# Altium project UWB_Project.PrjPcb
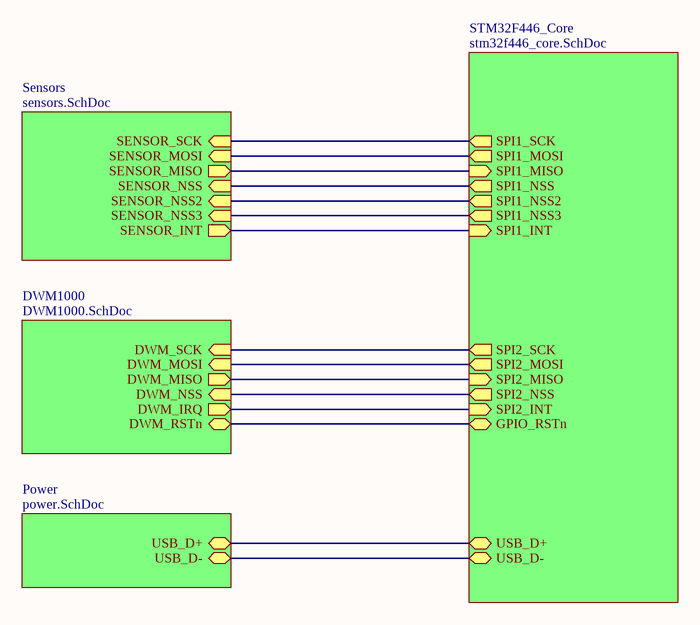
[diagram p0: Top_layer.SchDoc]
5 sheets, 79 parts. Net scope: hierarchical (ports join the sheet entries above them; power ports are global).
Board file: UWB_PCB.PcbDoc
Sheets:
  Top_layer.SchDoc
    STM32F446_Core = stm32f446_core.SchDoc
    Sensors = sensors.SchDoc
    DWM1000 = DWM1000.SchDoc
    Power = power.SchDoc

## Sheet Top_layer.SchDoc
size A

### Sub-sheets
DWM1000 = DWM1000.SchDoc: DWM_NSS (in), DWM_IRQ (out), DWM_MISO (out), DWM_SCK (in), DWM_MOSI (in), DWM_RSTn (bidir)
Power = power.SchDoc: USB_D+ (bidir), USB_D- (bidir)
Sensors = sensors.SchDoc: SENSOR_SCK (in), SENSOR_MOSI (in), SENSOR_MISO (out), SENSOR_NSS (in), SENSOR_NSS2 (in), SENSOR_NSS3 (in), SENSOR_INT (out)
STM32F446_Core = stm32f446_core.SchDoc: USB_D+ (bidir), USB_D- (bidir), SPI1_SCK (out), SPI1_MOSI (out), SPI1_MISO (in), SPI1_NSS (out), SPI1_NSS2 (out), SPI1_NSS3 (out), SPI1_INT (in), SPI2_SCK (out), SPI2_MOSI (out), SPI2_MISO (in), SPI2_NSS (out), SPI2_INT (in), GPIO_RSTn (bidir)

### Nets
AK8975_INT: sheet STM32F446_Core/SPI1_INT, sheet Sensors/SENSOR_INT
AK8975_MISO: sheet STM32F446_Core/SPI1_MISO, sheet Sensors/SENSOR_MISO
AK8975_MOSI: sheet STM32F446_Core/SPI1_MOSI, sheet Sensors/SENSOR_MOSI
AK8975_NSS: sheet STM32F446_Core/SPI1_NSS2, sheet Sensors/SENSOR_NSS2
AK8975_SCK: sheet STM32F446_Core/SPI1_SCK, sheet Sensors/SENSOR_SCK
DWM1000_IRQ: sheet STM32F446_Core/SPI2_INT, sheet DWM1000/DWM_IRQ
DWM1000_MISO: sheet STM32F446_Core/SPI2_MISO, sheet DWM1000/DWM_MISO
DWM1000_MOSI: sheet STM32F446_Core/SPI2_MOSI, sheet DWM1000/DWM_MOSI
DWM1000_NSS: sheet STM32F446_Core/SPI2_NSS, sheet DWM1000/DWM_NSS
DWM1000_RSTn: sheet STM32F446_Core/GPIO_RSTn, sheet DWM1000/DWM_RSTn
DWM1000_SCK: sheet STM32F446_Core/SPI2_SCK, sheet DWM1000/DWM_SCK
ICM20602_NSS: sheet STM32F446_Core/SPI1_NSS, sheet Sensors/SENSOR_NSS
PA11_USB_OTG_FS_DM: sheet STM32F446_Core/USB_D-, sheet Power/USB_D-
PA12_USB_OTG_FS_DP: sheet STM32F446_Core/USB_D+, sheet Power/USB_D+
PB13_SPI1_NSS3: sheet STM32F446_Core/SPI1_NSS3, sheet Sensors/SENSOR_NSS3

## Sheet stm32f446_core.SchDoc
size A3
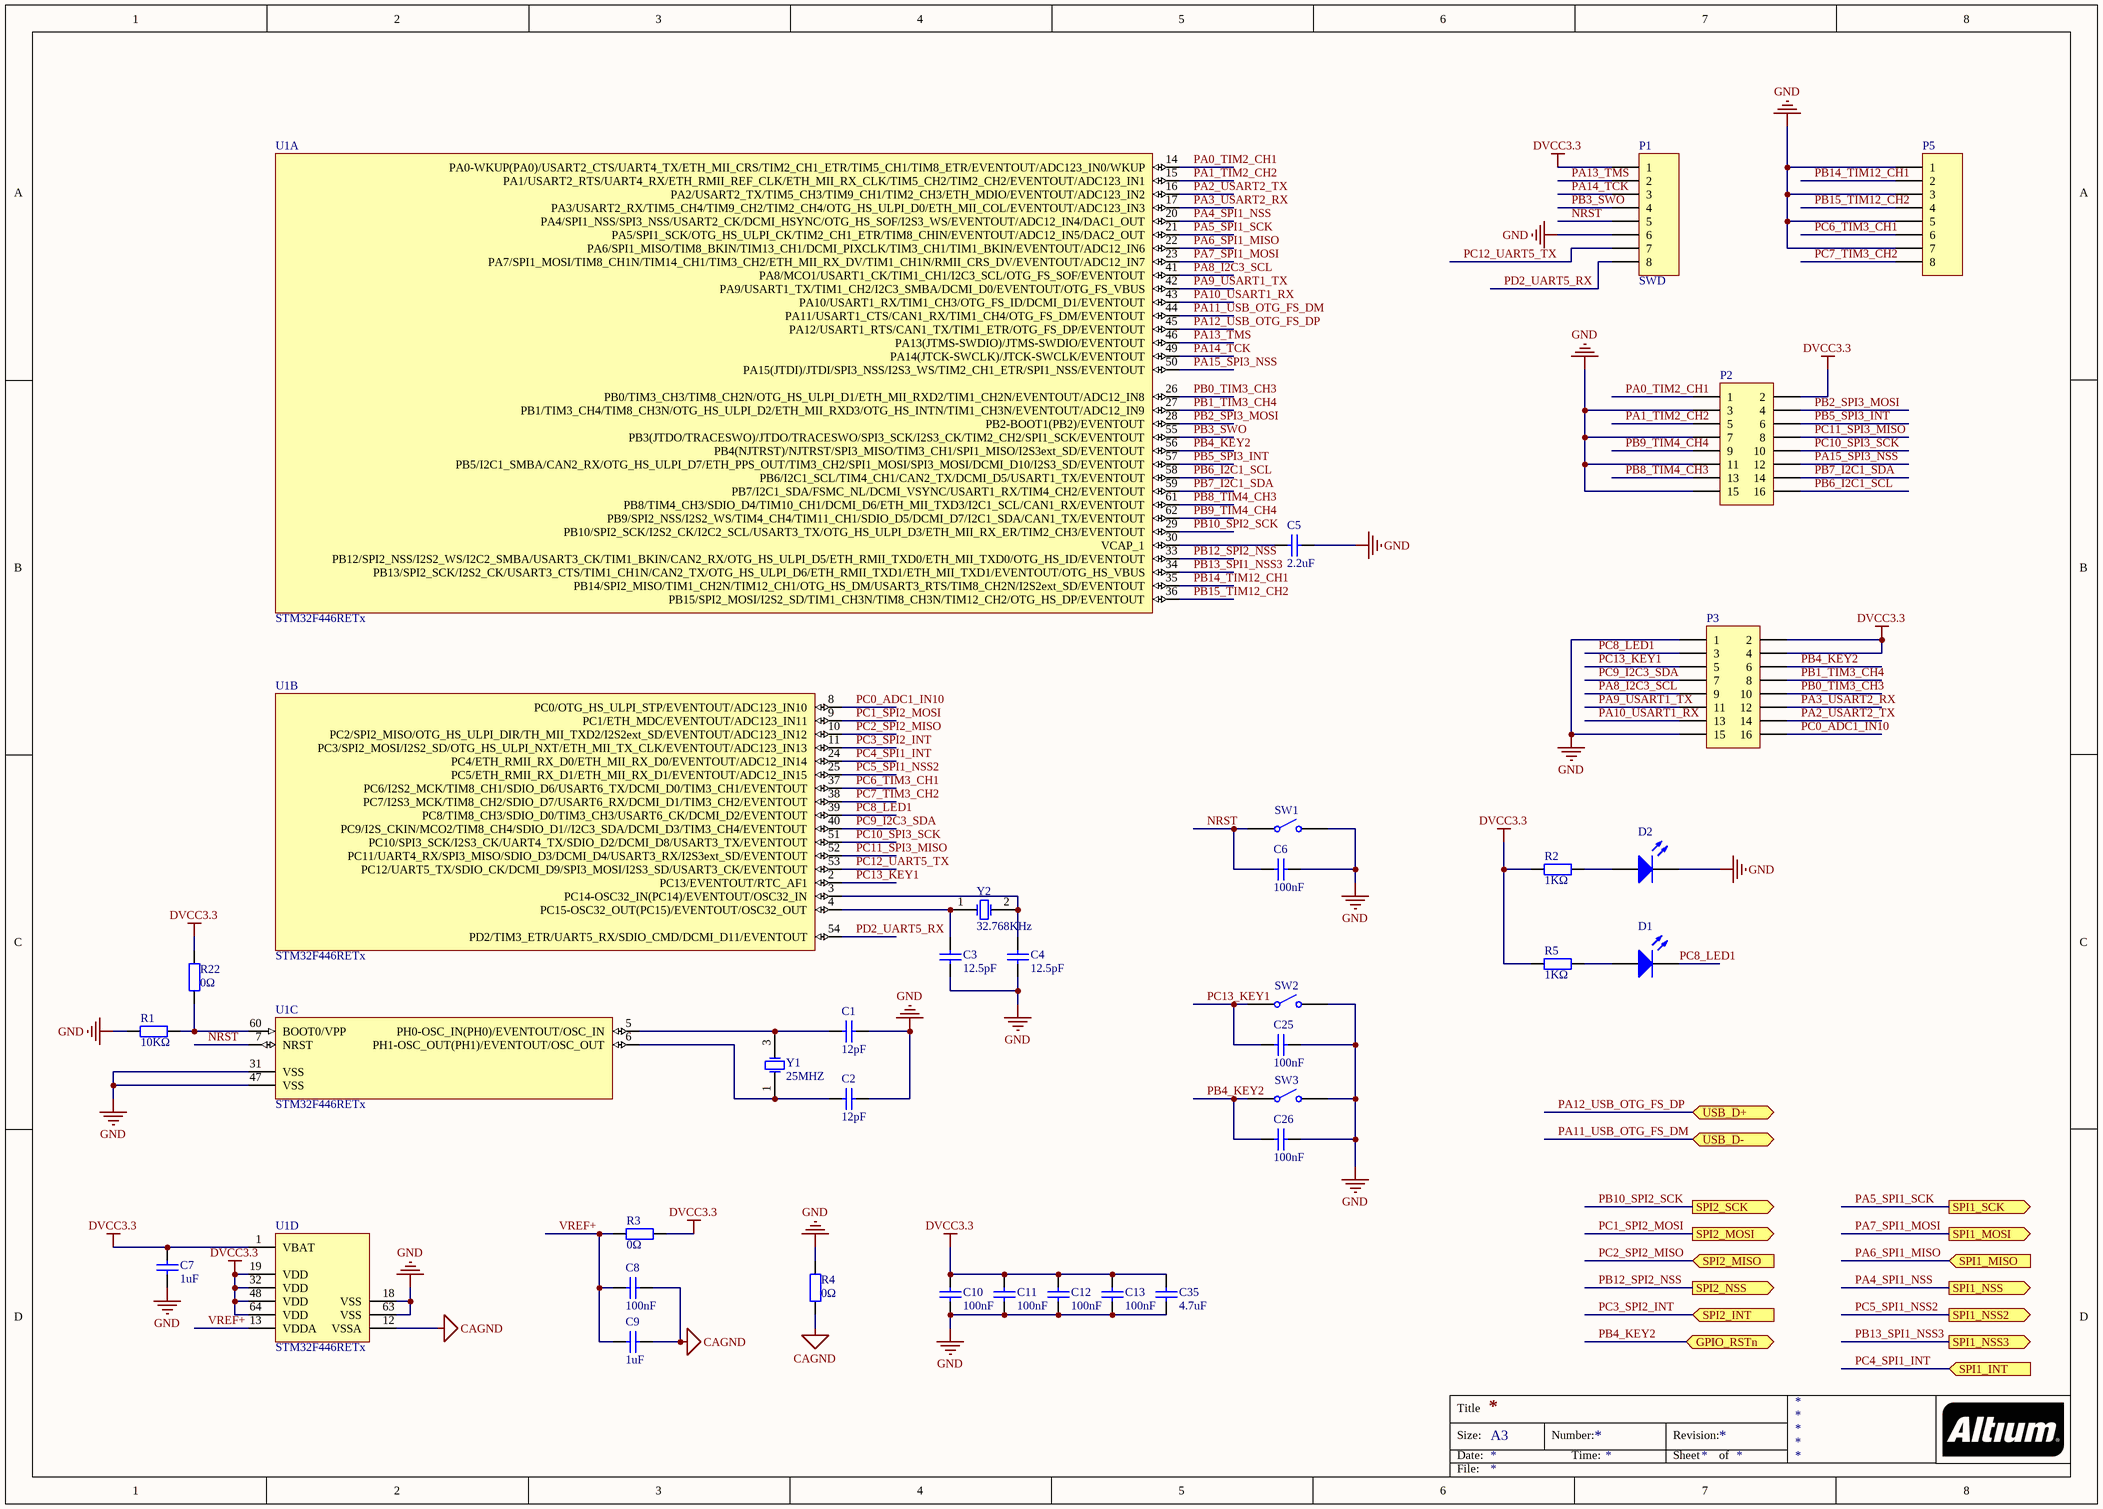
[diagram p1: stm32f446_core.SchDoc]

### Parts
C1  12pF  [0603_C]
C2  12pF  [0603_C]
C3  12.5pF  [0603_C]
C4  12.5pF  [0603_C]
C5  2.2uF  [0603_C]
C6  100nF  [0603_C]
C7  1uF  [0603_C]
C8  100nF  [0603_C]
C9  1uF  [0603_C]
C10  100nF  [0603_C]
C11  100nF  [0603_C]
C12  100nF  [0603_C]
C13  100nF  [0603_C]
C25  100nF  [0603_C]
C26  100nF  [0603_C]
C35  4.7uF  [0603_C]
D1  蓝灯 0805  [0805_LED_S1]  (value not drawn)
D2  蓝灯 0805  [0805_LED_S1]  (value not drawn)
P1  SWD  [HDR1X8]
P2  Header 8X2  [HDR2X8]  (value not drawn)
P3  Header 8X2  [HDR2X8]  (value not drawn)
P5  Header 8  [HDR1X8]  (value not drawn)
R1  10KΩ  [0603_R]
R2  1KΩ  [0603_R]
R3  0Ω  [0603_R]
R4  0Ω  [0603_R]
R5  1KΩ  [0603_R]
R22  0Ω  [0603_R]
SW1  434111025826  [434111025826]  (value not drawn)
SW2  434111025826  [434111025826]  (value not drawn)
SW3  434111025826  [434111025826]  (value not drawn)
U1  STM32F446RETx  [LQFP-64_10x10x05P]  (parts A,B,C,D of 4)
Y1  25MHZ  [SMD-3225_4P]
Y2  32.768KHz  [SMD-3215_2P FC - 135]

### Ports
GPIO_RSTn (bidir), SPI1_INT (in), SPI1_MISO (in), SPI1_MOSI (out), SPI1_NSS2 (out), SPI1_NSS3 (out), SPI1_NSS (out), SPI1_SCK (out), SPI2_INT (in), SPI2_MISO (in), SPI2_MOSI (out), SPI2_NSS (out), SPI2_SCK (out), USB_D+ (bidir), USB_D- (bidir)

### Nets
CAGND: C8.2 C9.2 R4.1 U1.12(VSSA)
DVCC3.3: C7.2 C10.2 C11.2 C12.2 C13.1 C35.2 P1.1 P2.2 P3.2 P3.4 R2.1 R3.2 R5.1 R22.2 U1.1(VBAT) U1.19(VDD) U1.32(VDD) U1.48(VDD) U1.64(VDD)
GND: C1.2 C2.2 C3.1 C4.1 C5.1 C6.2 C7.1 C10.1 C11.1 C12.1 C13.2 C25.2 C26.2 C35.1 D2.K P1.6 P2.3 P2.7 P2.11 P2.15 P3.1 P3.15 P5.1 P5.3 P5.5 P5.7 R1.1 R4.2 SW1.2 SW2.2 SW3.2 U1.18(VSS) U1.31(VSS) U1.47(VSS) U1.63(VSS)
NRST: C6.1 P1.5 SW1.1 U1.7(NRST)
PA0_TIM2_CH1: P2.1 U1.14(PA0-WKUP(PA0)/USART2_CTS/UART4_TX/ETH_MII_CRS/TIM2_CH1_ETR/TIM5_CH1/TIM8_ETR/EVENTOUT/ADC123_IN0/WKUP)
PA1_TIM2_CH2: P2.5 U1.15(PA1/USART2_RTS/UART4_RX/ETH_RMII_REF_CLK/ETH_MII_RX_CLK/TIM5_CH2/TIM2_CH2/EVENTOUT/ADC123_IN1)
PA2_USART2_TX: P3.14 U1.16(PA2/USART2_TX/TIM5_CH3/TIM9_CH1/TIM2_CH3/ETH_MDIO/EVENTOUT/ADC123_IN2)
PA3_USART2_RX: P3.12 U1.17(PA3/USART2_RX/TIM5_CH4/TIM9_CH2/TIM2_CH4/OTG_HS_ULPI_D0/ETH_MII_COL/EVENTOUT/ADC123_IN3)
PA4_SPI1_NSS: U1.20(PA4/SPI1_NSS/SPI3_NSS/USART2_CK/DCMI_HSYNC/OTG_HS_SOF/I2S3_WS/EVENTOUT/ADC12_IN4/DAC1_OUT) ; port SPI1_NSS  [project net ICM20602_NSS]
PA5_SPI1_SCK: U1.21(PA5/SPI1_SCK/OTG_HS_ULPI_CK/TIM2_CH1_ETR/TIM8_CHIN/EVENTOUT/ADC12_IN5/DAC2_OUT) ; port SPI1_SCK  [project net AK8975_SCK]
PA6_SPI1_MISO: U1.22(PA6/SPI1_MISO/TIM8_BKIN/TIM13_CH1/DCMI_PIXCLK/TIM3_CH1/TIM1_BKIN/EVENTOUT/ADC12_IN6) ; port SPI1_MISO  [project net AK8975_MISO]
PA7_SPI1_MOSI: U1.23(PA7/SPI1_MOSI/TIM8_CH1N/TIM14_CH1/TIM3_CH2/ETH_MII_RX_DV/TIM1_CH1N/RMII_CRS_DV/EVENTOUT/ADC12_IN7) ; port SPI1_MOSI  [project net AK8975_MOSI]
PA8_I2C3_SCL: P3.9 U1.41(PA8/MCO1/USART1_CK/TIM1_CH1/I2C3_SCL/OTG_FS_SOF/EVENTOUT)
PA9_USART1_TX: P3.11 U1.42(PA9/USART1_TX/TIM1_CH2/I2C3_SMBA/DCMI_D0/EVENTOUT/OTG_FS_VBUS)
PA10_USART1_RX: P3.13 U1.43(PA10/USART1_RX/TIM1_CH3/OTG_FS_ID/DCMI_D1/EVENTOUT)
PA11_USB_OTG_FS_DM: U1.44(PA11/USART1_CTS/CAN1_RX/TIM1_CH4/OTG_FS_DM/EVENTOUT) ; port USB_D-
PA12_USB_OTG_FS_DP: U1.45(PA12/USART1_RTS/CAN1_TX/TIM1_ETR/OTG_FS_DP/EVENTOUT) ; port USB_D+
PA13_TMS: P1.2 U1.46(PA13(JTMS-SWDIO)/JTMS-SWDIO/EVENTOUT)
PA14_TCK: P1.3 U1.49(PA14(JTCK-SWCLK)/JTCK-SWCLK/EVENTOUT)
PA15_SPI3_NSS: P2.12 U1.50(PA15(JTDI)/JTDI/SPI3_NSS/I2S3_WS/TIM2_CH1_ETR/SPI1_NSS/EVENTOUT)
PB0_TIM3_CH3: P3.10 U1.26(PB0/TIM3_CH3/TIM8_CH2N/OTG_HS_ULPI_D1/ETH_MII_RXD2/TIM1_CH2N/EVENTOUT/ADC12_IN8)
PB1_TIM3_CH4: P3.8 U1.27(PB1/TIM3_CH4/TIM8_CH3N/OTG_HS_ULPI_D2/ETH_MII_RXD3/OTG_HS_INTN/TIM1_CH3N/EVENTOUT/ADC12_IN9)
PB2_SPI3_MOSI: P2.4 U1.28(PB2-BOOT1(PB2)/EVENTOUT)
PB3_SWO: P1.4 U1.55(PB3(JTDO/TRACESWO)/JTDO/TRACESWO/SPI3_SCK/I2S3_CK/TIM2_CH2/SPI1_SCK/EVENTOUT)
PB4_KEY2: C26.1 P3.6 SW3.1 U1.56(PB4(NJTRST)/NJTRST/SPI3_MISO/TIM3_CH1/SPI1_MISO/I2S3ext_SD/EVENTOUT) ; port GPIO_RSTn  [project net DWM1000_RSTn]
PB5_SPI3_INT: P2.6 U1.57(PB5/I2C1_SMBA/CAN2_RX/OTG_HS_ULPI_D7/ETH_PPS_OUT/TIM3_CH2/SPI1_MOSI/SPI3_MOSI/DCMI_D10/I2S3_SD/EVENTOUT)
PB6_I2C1_SCL: P2.16 U1.58(PB6/I2C1_SCL/TIM4_CH1/CAN2_TX/DCMI_D5/USART1_TX/EVENTOUT)
PB7_I2C1_SDA: P2.14 U1.59(PB7/I2C1_SDA/FSMC_NL/DCMI_VSYNC/USART1_RX/TIM4_CH2/EVENTOUT)
PB8_TIM4_CH3: P2.13 U1.61(PB8/TIM4_CH3/SDIO_D4/TIM10_CH1/DCMI_D6/ETH_MII_TXD3/I2C1_SCL/CAN1_RX/EVENTOUT)
PB9_TIM4_CH4: P2.9 U1.62(PB9/SPI2_NSS/I2S2_WS/TIM4_CH4/TIM11_CH1/SDIO_D5/DCMI_D7/I2C1_SDA/CAN1_TX/EVENTOUT)
PB10_SPI2_SCK: U1.29(PB10/SPI2_SCK/I2S2_CK/I2C2_SCL/USART3_TX/OTG_HS_ULPI_D3/ETH_MII_RX_ER/TIM2_CH3/EVENTOUT) ; port SPI2_SCK  [project net DWM1000_SCK]
PB12_SPI2_NSS: U1.33(PB12/SPI2_NSS/I2S2_WS/I2C2_SMBA/USART3_CK/TIM1_BKIN/CAN2_RX/OTG_HS_ULPI_D5/ETH_RMII_TXD0/ETH_MII_TXD0/OTG_HS_ID/EVENTOUT) ; port SPI2_NSS  [project net DWM1000_NSS]
PB13_SPI1_NSS3: U1.34(PB13/SPI2_SCK/I2S2_CK/USART3_CTS/TIM1_CH1N/CAN2_TX/OTG_HS_ULPI_D6/ETH_RMII_TXD1/ETH_MII_TXD1/EVENTOUT/OTG_HS_VBUS) ; port SPI1_NSS3
PB14_TIM12_CH1: P5.2 U1.35(PB14/SPI2_MISO/TIM1_CH2N/TIM12_CH1/OTG_HS_DM/USART3_RTS/TIM8_CH2N/I2S2ext_SD/EVENTOUT)
PB15_TIM12_CH2: P5.4 U1.36(PB15/SPI2_MOSI/I2S2_SD/TIM1_CH3N/TIM8_CH3N/TIM12_CH2/OTG_HS_DP/EVENTOUT)
PC0_ADC1_IN10: P3.16 U1.8(PC0/OTG_HS_ULPI_STP/EVENTOUT/ADC123_IN10)
PC1_SPI2_MOSI: U1.9(PC1/ETH_MDC/EVENTOUT/ADC123_IN11) ; port SPI2_MOSI  [project net DWM1000_MOSI]
PC2_SPI2_MISO: U1.10(PC2/SPI2_MISO/OTG_HS_ULPI_DIR/TH_MII_TXD2/I2S2ext_SD/EVENTOUT/ADC123_IN12) ; port SPI2_MISO  [project net DWM1000_MISO]
PC3_SPI2_INT: U1.11(PC3/SPI2_MOSI/I2S2_SD/OTG_HS_ULPI_NXT/ETH_MII_TX_CLK/EVENTOUT/ADC123_IN13) ; port SPI2_INT  [project net DWM1000_IRQ]
PC4_SPI1_INT: U1.24(PC4/ETH_RMII_RX_D0/ETH_MII_RX_D0/EVENTOUT/ADC12_IN14) ; port SPI1_INT  [project net AK8975_INT]
PC5_SPI1_NSS2: U1.25(PC5/ETH_RMII_RX_D1/ETH_MII_RX_D1/EVENTOUT/ADC12_IN15) ; port SPI1_NSS2  [project net AK8975_NSS]
PC6_TIM3_CH1: P5.6 U1.37(PC6/I2S2_MCK/TIM8_CH1/SDIO_D6/USART6_TX/DCMI_D0/TIM3_CH1/EVENTOUT)
PC7_TIM3_CH2: P5.8 U1.38(PC7/I2S3_MCK/TIM8_CH2/SDIO_D7/USART6_RX/DCMI_D1/TIM3_CH2/EVENTOUT)
PC8_LED1: D1.K P3.3 U1.39(PC8/TIM8_CH3/SDIO_D0/TIM3_CH3/USART6_CK/DCMI_D2/EVENTOUT)
PC9_I2C3_SDA: P3.7 U1.40(PC9/I2S_CKIN/MCO2/TIM8_CH4/SDIO_D1//I2C3_SDA/DCMI_D3/TIM3_CH4/EVENTOUT)
PC10_SPI3_SCK: P2.10 U1.51(PC10/SPI3_SCK/I2S3_CK/UART4_TX/SDIO_D2/DCMI_D8/USART3_TX/EVENTOUT)
PC11_SPI3_MISO: P2.8 U1.52(PC11/UART4_RX/SPI3_MISO/SDIO_D3/DCMI_D4/USART3_RX/I2S3ext_SD/EVENTOUT)
PC12_UART5_TX: P1.7 U1.53(PC12/UART5_TX/SDIO_CK/DCMI_D9/SPI3_MOSI/I2S3_SD/USART3_CK/EVENTOUT)
PC13_KEY1: C25.1 P3.5 SW2.1 U1.2(PC13/EVENTOUT/RTC_AF1)
PD2_UART5_RX: P1.8 U1.54(PD2/TIM3_ETR/UART5_RX/SDIO_CMD/DCMI_D11/EVENTOUT)
VREF+: C8.1 C9.1 R3.1 U1.13(VDDA)
NetC1_1: C1.1 U1.5(PH0-OSC_IN(PH0)/EVENTOUT/OSC_IN) Y1.3(OSC2)
NetC2_1: C2.1 U1.6(PH1-OSC_OUT(PH1)/EVENTOUT/OSC_OUT) Y1.1(OSC1)
NetC3_2: C3.2 U1.4(PC15-OSC32_OUT(PC15)/EVENTOUT/OSC32_OUT) Y2.1(OSC1)
NetC4_2: C4.2 U1.3(PC14-OSC32_IN(PC14)/EVENTOUT/OSC32_IN) Y2.2(OSC2)
NetC5_2: C5.2 U1.30(VCAP_1)
NetD1_A: D1.A R5.2
NetD2_A: D2.A R2.2
NetR1_2: R1.2 R22.1 U1.60(BOOT0/VPP)

### Notes on the sheet
- Title
- Size:
- Date:
- A3
- Number:
- Time:
- Revision:
- Sheet
- of
- File:

### Library data of the parts
C1-C4 = 0603 12pF (120) 5% 50V: 贴片电容; ComponentLink1Description: 供应商链接; ComponentLink1URL: http://www.szlcsc.com/product/details_39506.html; Package: 0603; Supplier: LC; SuppliersPartNumber: C38523
C5 = 0603 2.2uF (225) 10% 16V: 贴片电容; ComponentLink1Description: 供应商链接; ComponentLink1URL: http://www.szlcsc.com/product/details_24366.html; Package: 0603; Supplier: LC; SuppliersPartNumber: C23630
C6 C8 C10-C13 C25 C26 = 0603 100nF (104) 10% 50V: 贴片电容; ComponentLink1Description: 供应商链接; ComponentLink1URL: http://www.szlcsc.com/product/details_15331.html; Package: 0603; Supplier: LC; SuppliersPartNumber: C14663
C7 C9 = 0603 1uF (105) 10% 50V: 贴片电容; ComponentLink1Description: 供应商链接; ComponentLink1URL: http://www.szlcsc.com/product/details_16531.html; Package: 0603; Supplier: LC; SuppliersPartNumber: C15849
C35 = 0603 4.7uF (475) 10% 16V: 贴片电容; ComponentLink1Description: 供应商链接; ComponentLink1URL: http://www.szlcsc.com/product/details_20375.html; Package: 0603; Supplier: LC; SuppliersPartNumber: C19666
D1 D2 = 0805 蓝灯: 发光二极管; ComponentLink1Description: 供应商链接; ComponentLink1URL: http://www.szlcsc.com/product/details_2666.html; Package: 0805; Supplier: LC; SuppliersPartNumber: C2293
P1 P5 = Header 8: Header, 8-Pin; LatestRevisionDate: 17-Jul-2002; LatestRevisionNote: Re-released for DXP Platform.; Publisher: Altium Limited
P2 P3 = Header 8X2: Header, 8-Pin, Dual row; LatestRevisionDate: 17-Jul-2002; LatestRevisionNote: Re-released for DXP Platform.; Publisher: Altium Limited
R1 = 0603 10KΩ (1002) 1%: 贴片电阻; ComponentLink1Description: 供应商链接; ComponentLink1URL: http://www.szlcsc.com/product/details_26547.html; Package: 0603; Supplier: LC; SuppliersPartNumber: C25804
R2 R5 = 0603 1KΩ (1001) 1%: 贴片电阻; ComponentLink1Description: 供应商链接; ComponentLink1URL: http://www.szlcsc.com/product/details_21904.html; Package: 0603; Supplier: LC; SuppliersPartNumber: C21190
R3 R4 R22 = 0603 0Ω (0R0) 1%: 贴片电阻; ComponentLink1Description: 供应商链接; ComponentLink1URL: http://www.szlcsc.com/product/details_21903.html; Package: 0603; Supplier: LC; SuppliersPartNumber: C21189
SW1-SW3 = 434111025826: WS-TASV SMD Tact Switch 6.0X3.8 mm; NoPins: 02; PackageReference: 434111025826; PartNumber: 434111025826; ComponentLink1Description: Manufacturer URL; ComponentLink1URL: http://www.we-online.com; ComponentLink2Description: Datasheet; ComponentLink2URL: http://katalog.we-online.de/em/datasheet/434111025826.pdf
U1 = STM32F405RGT6: ARM; ComponentLink1Description: 供应商链接; ComponentLink1URL: http://www.szlcsc.com/product/details_16424.html; Package: LQFP-64_10x10x05P; Supplier: LC; SuppliersPartNumber: C15742
Y1 = SMD-3225_4P  25MHZ 12PF 10PPM: 贴片晶振; ComponentLink1Description: 供应商链接; ComponentLink1URL: http://www.szlcsc.com/product/details_9526.html; Package: SMD-3225_4P; Supplier: LC; SuppliersPartNumber: C9006
Y2 = SMD-3215_2P 32.768KHz 20ppm 12.5pF: 贴片晶振; ComponentLink1Description: 供应商链接; ComponentLink1URL: http://www.szlcsc.com/product/details_33310.html; Package: SMD-3215_2P; Supplier: LC; SuppliersPartNumber: C32346

## Sheet sensors.SchDoc
size A
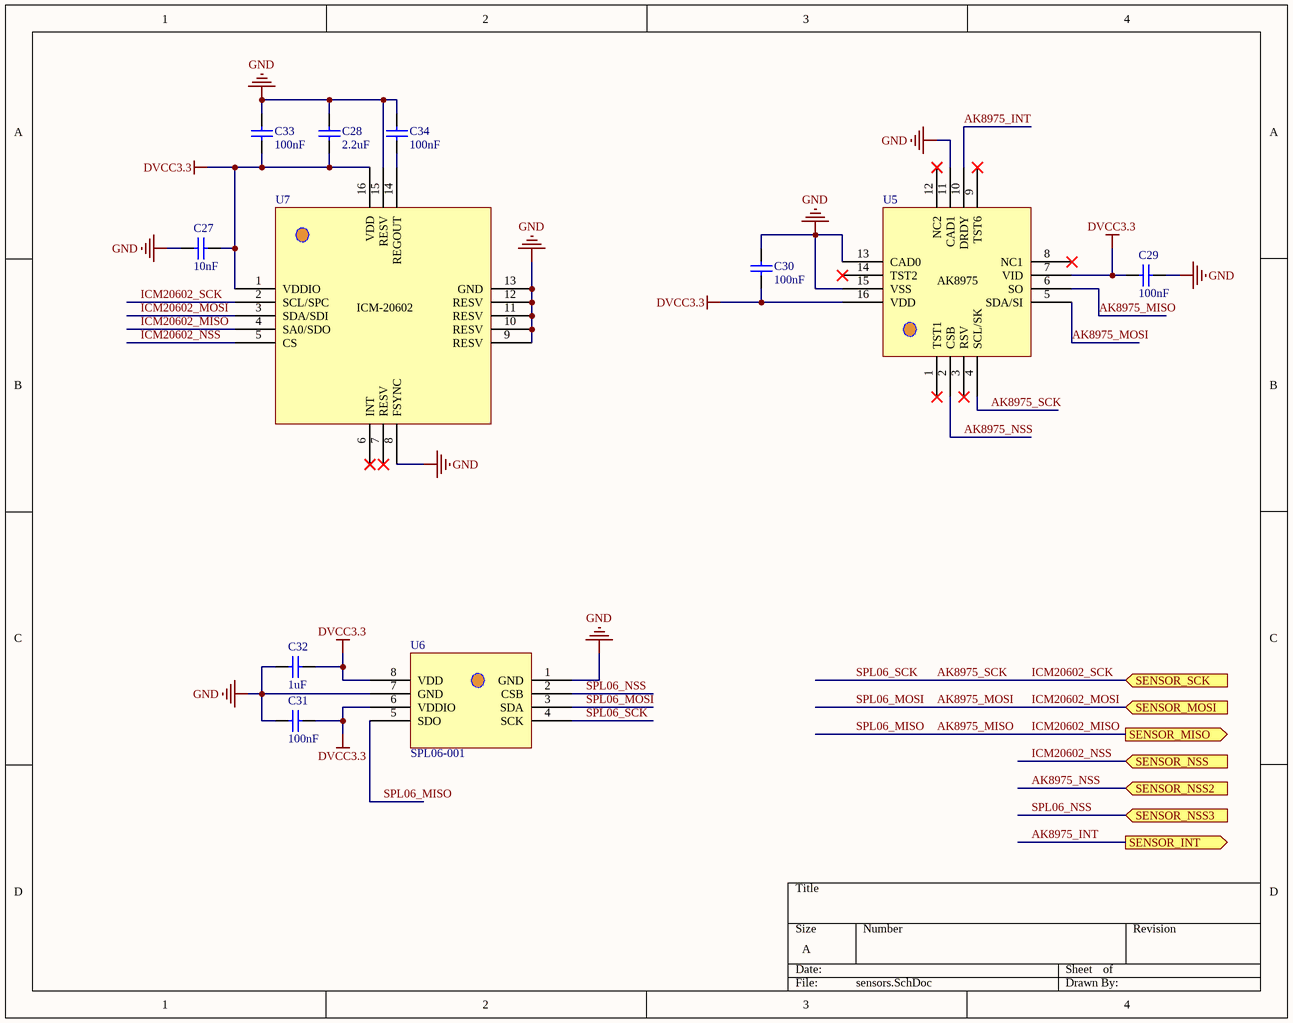
[diagram p2: sensors.SchDoc]

### Parts
C27  10nF  [0603_C]
C28  2.2uF  [0603_C]
C29  100nF  [0603_C]
C30  100nF  [0603_C]
C31  100nF  [0603_C]
C32  1uF  [0603_C]
C33  100nF  [0603_C]
C34  100nF  [0603_C]
U5  AK8975  [AK8975 QFN 16P 400X400X80_HS-17N]  (value not drawn)
U6  SPL06-001  [spl06-001 LGA 8P 4X2_250X200X100]
U7  ICM-20602 6-Axis MEMS  [ICM-20602 LGA]  (value not drawn)

### Ports
SENSOR_INT (out), SENSOR_MISO (out), SENSOR_MOSI (in), SENSOR_NSS2 (in), SENSOR_NSS3 (in), SENSOR_NSS (in), SENSOR_SCK (in)

### Nets
DVCC3.3: C27.2 C28.1 C29.2 C30.2 C31.1 C32.2 C33.1 U5.7(VID) U5.16(VDD) U6.6(VDDIO) U6.8(VDD) U7.1(VDDIO) U7.16(VDD)
GND: C27.1 C28.2 C29.1 C30.1 C31.2 C32.1 C33.2 C34.2 U5.11(CAD1) U5.13(CAD0) U5.15(VSS) U6.1(GND) U6.7(GND) U7.8(FSYNC) U7.9(RESV) U7.10(RESV) U7.11(RESV) U7.12(RESV) U7.13(GND) U7.15(RESV)
AK8975_INT: U5.10(DRDY) ; port SENSOR_INT
AK8975_MISO: U5.6(SO) U6.5(SDO) U7.4(SA0/SDO) ; port SENSOR_MISO  [also labelled ICM20602_MISO, SPL06_MISO]
AK8975_MOSI: U5.5(SDA/SI) U6.3(SDA) U7.3(SDA/SDI) ; port SENSOR_MOSI  [also labelled ICM20602_MOSI, SPL06_MOSI]
AK8975_NSS: U5.2(CSB) ; port SENSOR_NSS2
AK8975_SCK: U5.4(SCL/SK) U6.4(SCK) U7.2(SCL/SPC) ; port SENSOR_SCK  [also labelled ICM20602_SCK, SPL06_SCK]
ICM20602_NSS: U7.5(CS) ; port SENSOR_NSS
SPL06_NSS: U6.2(CSB) ; port SENSOR_NSS3  [project net PB13_SPI1_NSS3]
NetC34_1: C34.1 U7.14(REGOUT)

Not connected (* = marked no-connect by the designer): U5 1(TST1)* 3(RSV)* 8(NC1)* 9(TST6)* 12(NC2)* 14(TST2)*; U7 6(INT)* 7(RESV)*

### Library data of the parts
C27 = 0603 10nF (103) 10% 50V: 贴片电容; ComponentLink1Description: 供应商链接; ComponentLink1URL: http://www.szlcsc.com/product/details_58143.html; Package: 0603; Supplier: LC; SuppliersPartNumber: C57112
C28 = 0603 2.2uF (225) 10% 16V: 贴片电容; ComponentLink1Description: 供应商链接; ComponentLink1URL: http://www.szlcsc.com/product/details_24366.html; Package: 0603; Supplier: LC; SuppliersPartNumber: C23630
C29-C31 C33 C34 = 0603 100nF (104) 10% 50V: 贴片电容; ComponentLink1Description: 供应商链接; ComponentLink1URL: http://www.szlcsc.com/product/details_15331.html; Package: 0603; Supplier: LC; SuppliersPartNumber: C14663
C32 = 0603 1uF (105) 10% 50V: 贴片电容; ComponentLink1Description: 供应商链接; ComponentLink1URL: http://www.szlcsc.com/product/details_16531.html; Package: 0603; Supplier: LC; SuppliersPartNumber: C15849
U7 = ICM-20602: High Performance 6-Axis MEMS MotionTracking Device

## Sheet DWM1000.SchDoc
size A
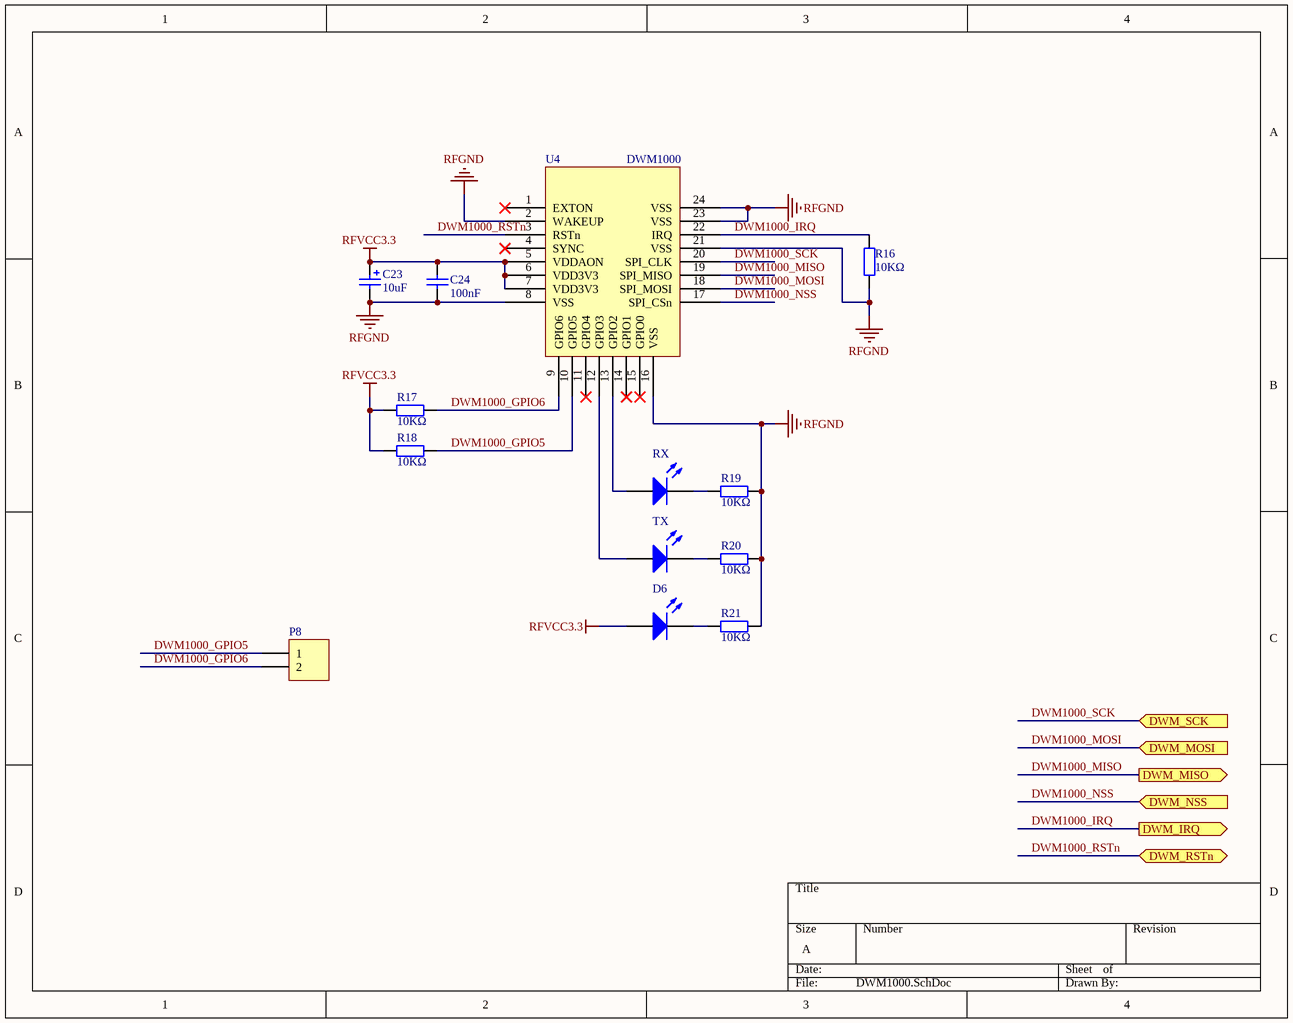
[diagram p3: DWM1000.SchDoc]

### Parts
C23  10uF  [CASE-A_3216]
C24  100nF  [0603_C]
D6  蓝灯 0805  [0805_LED_S1]  (value not drawn)
P8  Header 2  [HDR1X2]  (value not drawn)
R16  10KΩ  [0603_R]
R17  10KΩ  [0603_R]
R18  10KΩ  [0603_R]
R19  10KΩ  [0603_R]
R20  10KΩ  [0603_R]
R21  10KΩ  [0603_R]
RX  蓝灯 0805  [0805_LED_S1]  (value not drawn)
TX  蓝灯 0805  [0805_LED_S1]  (value not drawn)
U4  DWM1000  [DWM1000]

### Ports
DWM_IRQ (out), DWM_MISO (out), DWM_MOSI (in), DWM_NSS (in), DWM_RSTn (bidir), DWM_SCK (in)

### Nets
RFGND: C23.2 C24.1 R16.1 R19.1 R20.1 R21.1 U4.2(WAKEUP) U4.8(VSS) U4.16(VSS) U4.21(VSS) U4.23(VSS) U4.24(VSS)
RFVCC3.3: C23.1 C24.2 D6.A R17.2 R18.2 U4.5(VDDAON) U4.6(VDD3V3) U4.7(VDD3V3)
DWM1000_GPIO5: P8.1 R18.1 U4.10(GPIO5)
DWM1000_GPIO6: P8.2 R17.1 U4.9(GPIO6)
DWM1000_IRQ: R16.2 U4.22(IRQ) ; port DWM_IRQ
DWM1000_MISO: U4.19(SPI_MISO) ; port DWM_MISO
DWM1000_MOSI: U4.18(SPI_MOSI) ; port DWM_MOSI
DWM1000_NSS: U4.17(SPI_CSn) ; port DWM_NSS
DWM1000_RSTn: U4.3(RSTn) ; port DWM_RSTn
DWM1000_SCK: U4.20(SPI_CLK) ; port DWM_SCK
NetD6_K: D6.K R21.2
NetR19_2: R19.2 RX.K
NetR20_2: R20.2 TX.K
NetRX_A: RX.A U4.13(GPIO2)
NetTX_A: TX.A U4.12(GPIO3)

Not connected (* = marked no-connect by the designer): U4 1(EXTON)* 4(SYNC)* 11(GPIO4)* 14(GPIO1)* 15(GPIO0)*

### Library data of the parts
C23 = 3216 10uF (106) 10% 16V: 钽电容; ComponentLink1Description: 供应商链接; ComponentLink1URL: http://www.szlcsc.com/product/details_7643.html; Package: 3216; Supplier: LC; SuppliersPartNumber: C7171
C24 = 0603 100nF (104) 10% 50V: 贴片电容; ComponentLink1Description: 供应商链接; ComponentLink1URL: http://www.szlcsc.com/product/details_15331.html; Package: 0603; Supplier: LC; SuppliersPartNumber: C14663
D6 RX TX = 0805 蓝灯: 发光二极管; ComponentLink1Description: 供应商链接; ComponentLink1URL: http://www.szlcsc.com/product/details_2666.html; Package: 0805; Supplier: LC; SuppliersPartNumber: C2293
P8 = Header 2: Header, 2-Pin; LatestRevisionDate: 17-Jul-2002; LatestRevisionNote: Re-released for DXP Platform.; Publisher: Altium Limited
R16-R21 = 0603 10KΩ (1002) 1%: 贴片电阻; ComponentLink1Description: 供应商链接; ComponentLink1URL: http://www.szlcsc.com/product/details_26547.html; Package: 0603; Supplier: LC; SuppliersPartNumber: C25804

## Sheet power.SchDoc
size A
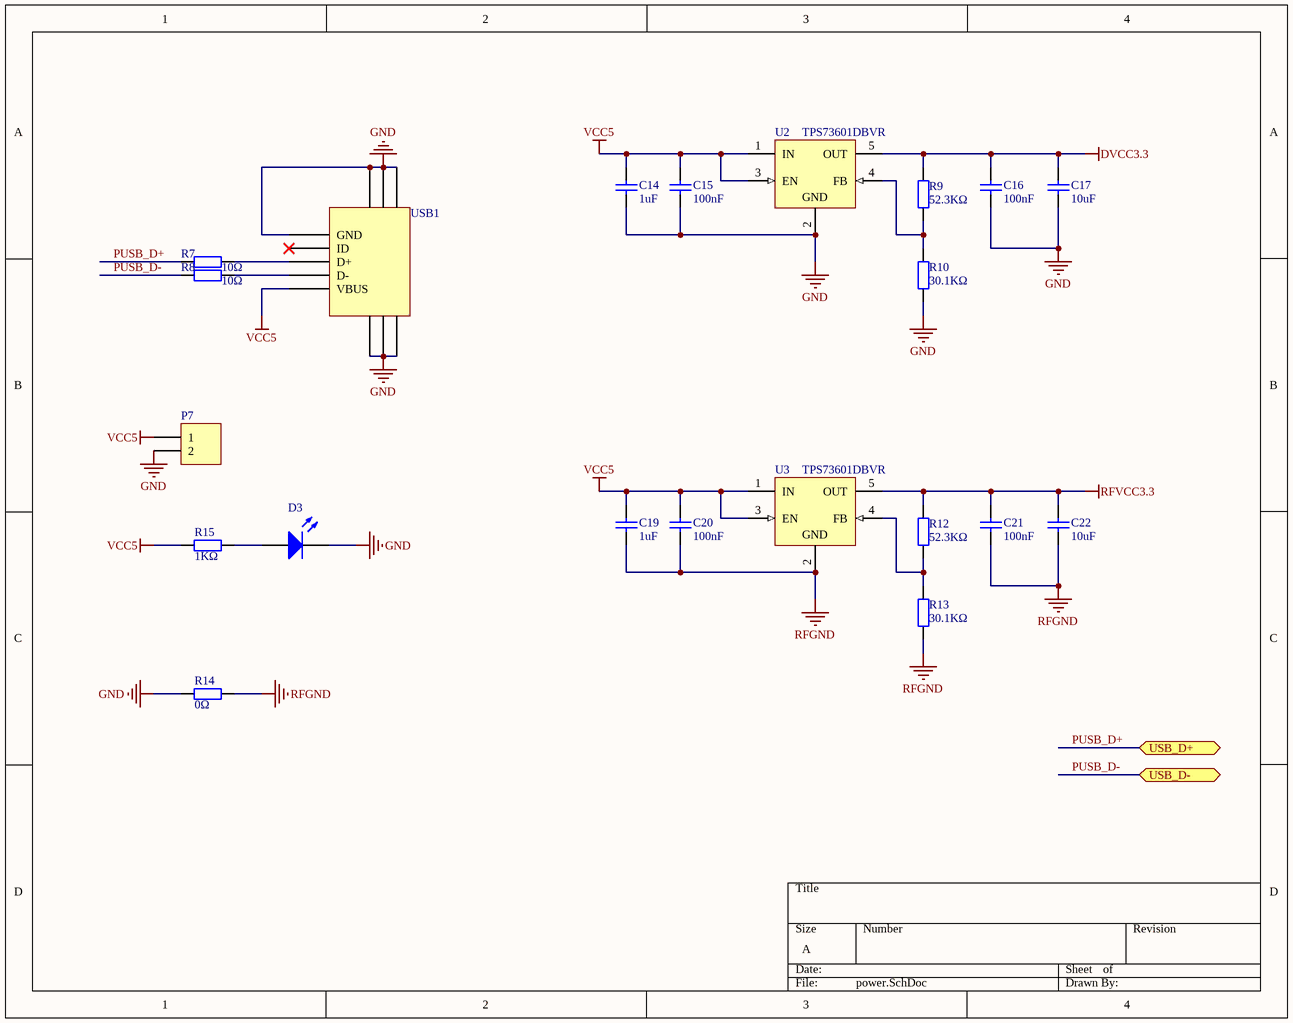
[diagram p4: power.SchDoc]

### Parts
C14  1uF  [0603_C]
C15  100nF  [0603_C]
C16  100nF  [0603_C]
C17  10uF  [0603_C]
C19  1uF  [0603_C]
C20  100nF  [0603_C]
C21  100nF  [0603_C]
C22  10uF  [0603_C]
D3  蓝灯 0805  [0805_LED_S1]  (value not drawn)
P7  Header 2  [HDR1X2]  (value not drawn)
R7  10Ω  [0603_R]
R8  10Ω  [0603_R]
R9  52.3KΩ  [0603_R]
R10  30.1KΩ  [0603_R]
R12  52.3KΩ  [0603_R]
R13  30.1KΩ  [0603_R]
R14  0Ω  [0603_R]
R15  1KΩ  [0603_R]
U2  TPS73601DBVR  [TI-DBV5_L]
U3  TPS73601DBVR  [TI-DBV5_L]
USB1  USB Micro B 1A  [MICRO-USB-1]  (value not drawn)

### Ports
USB_D+ (bidir), USB_D- (bidir)

### Nets
DVCC3.3: C16.2 C17.2 R9.2 U2.5(OUT)
GND: C14.1 C15.1 C16.1 C17.1 D3.K P7.2 R10.1 R14.1 U2.2(GND) USB1.0 USB1.5(GND)
RFGND: C19.1 C20.1 C21.1 C22.1 R13.1 R14.2 U3.2(GND)
RFVCC3.3: C21.2 C22.2 R12.2 U3.5(OUT)
VCC5: C14.2 C15.2 C19.2 C20.2 P7.1 R15.1 U2.1(IN) U2.3(EN) U3.1(IN) U3.3(EN) USB1.1(VBUS)
PUSB_D+: R7.1 ; port USB_D+  [project net PA12_USB_OTG_FS_DP]
PUSB_D-: R8.1 ; port USB_D-  [project net PA11_USB_OTG_FS_DM]
NetD3_A: D3.A R15.2
NetR7_2: R7.2 USB1.3(D+)
NetR8_2: R8.2 USB1.2(D-)
NetR9_1: R9.1 R10.2 U2.4(FB)
NetR12_1: R12.1 R13.2 U3.4(FB)

Not connected (* = marked no-connect by the designer): USB1 4(ID)*

### Library data of the parts
C14 C19 = 0603 1uF (105) 10% 50V: 贴片电容; ComponentLink1Description: 供应商链接; ComponentLink1URL: http://www.szlcsc.com/product/details_16531.html; Package: 0603; Supplier: LC; SuppliersPartNumber: C15849
C15 C16 C20 C21 = 0603 100nF (104) 10% 50V: 贴片电容; ComponentLink1Description: 供应商链接; ComponentLink1URL: http://www.szlcsc.com/product/details_15331.html; Package: 0603; Supplier: LC; SuppliersPartNumber: C14663
C17 C22 = 0603 10uF (106) 10% 10V: 贴片电容; ComponentLink1Description: 供应商链接; ComponentLink1URL: http://www.szlcsc.com/product/details_20411.html; Package: 0603; Supplier: LC; SuppliersPartNumber: C19702
D3 = 0805 蓝灯: 发光二极管; ComponentLink1Description: 供应商链接; ComponentLink1URL: http://www.szlcsc.com/product/details_2666.html; Package: 0805; Supplier: LC; SuppliersPartNumber: C2293
P7 = Header 2: Header, 2-Pin; LatestRevisionDate: 17-Jul-2002; LatestRevisionNote: Re-released for DXP Platform.; Publisher: Altium Limited
R7 R8 = 0603 10Ω (10R0) 1%: 贴片电阻; ComponentLink1Description: 供应商链接; ComponentLink1URL: http://www.szlcsc.com/product/details_23586.html; Package: 0603; Supplier: LC; SuppliersPartNumber: C22859
R9 R12 = 0603 51KΩ (5102) 1%: 贴片电阻; ComponentLink1Description: 供应商链接; ComponentLink1URL: http://www.szlcsc.com/product/details_23923.html; Package: 0603; Supplier: LC; SuppliersPartNumber: C23196
R10 R13 = 0603 30KΩ (3002) 1%: 贴片电阻; ComponentLink1Description: 供应商链接; ComponentLink1URL: http://www.szlcsc.com/product/details_23711.html; Package: 0603; Supplier: LC; SuppliersPartNumber: C22984
R14 = 0603 0Ω (0R0) 1%: 贴片电阻; ComponentLink1Description: 供应商链接; ComponentLink1URL: http://www.szlcsc.com/product/details_21903.html; Package: 0603; Supplier: LC; SuppliersPartNumber: C21189
R15 = 0603 1KΩ (1001) 1%: 贴片电阻; ComponentLink1Description: 供应商链接; ComponentLink1URL: http://www.szlcsc.com/product/details_21904.html; Package: 0603; Supplier: LC; SuppliersPartNumber: C21190
U2 U3 = TPS73601DBVR: Single Output Low Noise LDO, 400 mA, Adjustable 1.2 to 5.5 V Output, 1.7 to 5.5 V Input, with Reverse Current Protection, 5-pin SOT-23 (DBV), -40 to 85 degC, Green (RoHS & no Sb/Br); Manufacturer: Texas Instruments; Accuracy(%): 1; Iout(Max)(A): 0.4; Iq(Typ)(mA): 0.3; Rating: Catalog; SubFamily: Single Channel LDO; Vdo(Typ)(mV): 75; Vin(Max)(V): 5.5; Vin(Min)(V): 1.7; Vout Adj(Min)(V): 1.2; DatasheetVersion: SBVS038T; PackageVersion: 4073253-4/K; PackageReference: DBV5; PackageDescription: 5-Pin Plastic Small Outline, Body 1.60 脳 2.90 mm, Pitch 0.95 mm; Supplier 1: Digi-Key; Supplier Part Number 1: 296-18255-2-ND; Supplier 2: Digi-Key; Supplier Part Number 2: 296-18255-1-ND; Supplier 3: Digi-Key; Supplier Part Number 3: 296-18255-6-ND; Supplier 4: Farnell; Supplier Part Number 4: 1576489; Supplier 5: Newark; Supplier Part Number 5: 87H2971; Supplier 6: Mouser; Supplier Part Number 6: 595-TPS73601DBVR; Eco-Plan: Green (RoHS & no Sb/Br); Vout Adj(Max)(V): 5.5; Mounting Technology: Surface Mount; Code_JEDEC: MO-178; PartNumber: TPS73601DBVR; ComponentLink1Description: Manufacturer URL; ComponentLink1URL: http://www.ti.com/; ComponentLink2Description: Datasheet; ComponentLink2URL: http://www.ti.com/general/docs/lit/getliterature.tsp?genericPartNumber=TPS73601&fileType=pdf; ComponentLink3Description: Package Specification; ComponentLink3URL: http://www.ti.com/litv/pdf/mpds018i; ComponentLink4Description: URL Link1; ComponentLink4URL: Samples URL:http://www.ti.com/product/tps73601#samples
USB1 = MICRO 5PFemaleBtype: ComponentLink1Description: Link; ComponentLink1URL: https://item.szlcsc.com/10961.html

## Nets that join several sheets
DVCC3.3: stm32f446_core (19 pins), sensors (13 pins), power (C16.2 C17.2 R9.2 U2.5)
GND: stm32f446_core (35 pins), sensors (20 pins), power (11 pins)
RFGND: DWM1000 (12 pins), power (7 pins)
RFVCC3.3: DWM1000 (8 pins), power (C21.2 C22.2 R12.2 U3.5)
AK8975_INT: stm32f446_core (U1.24), sensors (U5.10)
AK8975_MISO: stm32f446_core (U1.22), sensors (U5.6 U6.5 U7.4)
AK8975_MOSI: stm32f446_core (U1.23), sensors (U5.5 U6.3 U7.3)
AK8975_NSS: stm32f446_core (U1.25), sensors (U5.2)
AK8975_SCK: stm32f446_core (U1.21), sensors (U5.4 U6.4 U7.2)
DWM1000_IRQ: stm32f446_core (U1.11), DWM1000 (R16.2 U4.22)
DWM1000_MISO: stm32f446_core (U1.10), DWM1000 (U4.19)
DWM1000_MOSI: stm32f446_core (U1.9), DWM1000 (U4.18)
DWM1000_NSS: stm32f446_core (U1.33), DWM1000 (U4.17)
DWM1000_RSTn: stm32f446_core (C26.1 P3.6 SW3.1 U1.56), DWM1000 (U4.3)
DWM1000_SCK: stm32f446_core (U1.29), DWM1000 (U4.20)
ICM20602_NSS: stm32f446_core (U1.20), sensors (U7.5)
PA11_USB_OTG_FS_DM: stm32f446_core (U1.44), power (R8.1)
PA12_USB_OTG_FS_DP: stm32f446_core (U1.45), power (R7.1)
PB13_SPI1_NSS3: stm32f446_core (U1.34), sensors (U6.2)